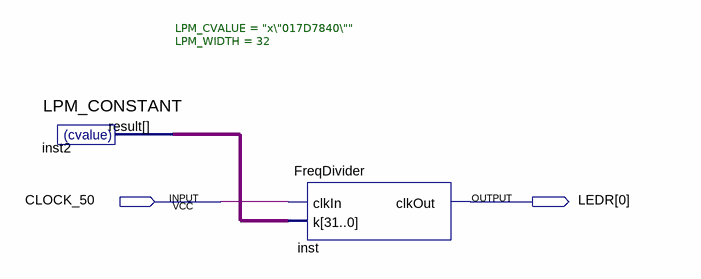
[diagram p0: schematic sheet]
// Quartus schematic FreqDivider_Demo.bdf as structural Verilog: 2 symbols, 2 pins
module FreqDivider_Demo (
  input  CLOCK_50,
  output [0:0] LEDR
);

  wire [31:0] inst2_result;

  LPM_CONSTANT #(.LPM_CVALUE("x\"017D7840\""), .LPM_WIDTH(32)) inst2 (.result(inst2_result));
  FreqDivider inst (.clkIn(CLOCK_50), .k(inst2_result), .clkOut(LEDR[0]));
endmodule
